# Altium schematic sheet MRAM.SchDoc
size A4
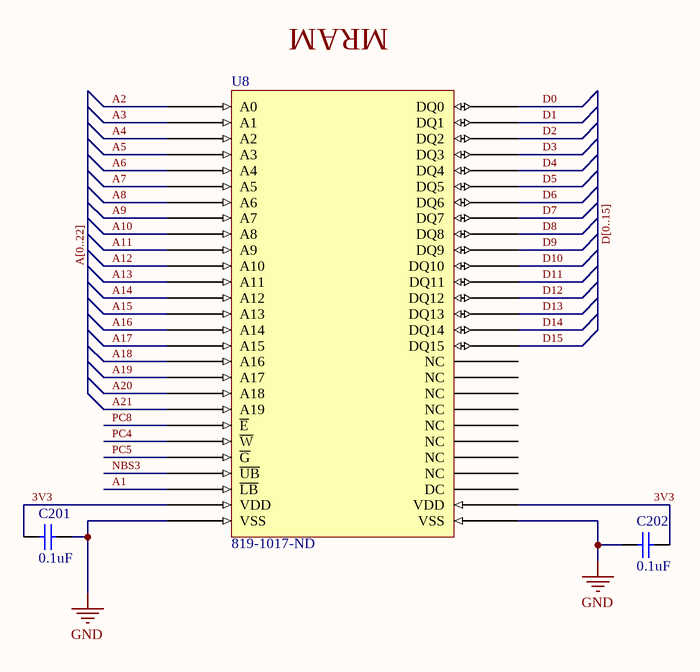
[diagram p0: MRAM.SchDoc]

## Parts
C201  value 0.1uF  [CAPC2008X06N]  (hidden comment: Kemet_0805_a_0.1uF)
C202  value 0.1uF  [CAPC2008X06N]  (hidden comment: Kemet_0805_a_0.1uF)
U8  Supplier Part Number 1: 819-1017-ND  [TSOP80P1180X120_HS-54N]  (hidden comment: MRAM (Magnetoresistive RAM))

## Nets
GND: C201.2 C202.1 U8.14(VSS) U8.42(VSS)
3V3: C201.1 C202.2 U8.13(VDD) U8.41(VDD)
A1: U8.47(~{LB})
A2: U8.3(A0)
A3: U8.4(A1)
A4: U8.5(A2)
A5: U8.6(A3)
A6: U8.7(A4)
A7: U8.20(A5)
A8: U8.21(A6)
A9: U8.22(A7)
A10: U8.23(A8)
A11: U8.24(A9)
A12: U8.31(A10)
A13: U8.32(A11)
A14: U8.33(A12)
A15: U8.34(A13)
A16: U8.35(A14)
A17: U8.50(A15)
A18: U8.51(A16)
A19: U8.52(A17)
A20: U8.53(A18)
A21: U8.2(A19)
D0: U8.9(DQ0)
D1: U8.10(DQ1)
D2: U8.11(DQ2)
D3: U8.12(DQ3)
D4: U8.15(DQ4)
D5: U8.16(DQ5)
D6: U8.17(DQ6)
D7: U8.18(DQ7)
D8: U8.37(DQ8)
D9: U8.38(DQ9)
D10: U8.39(DQ10)
D11: U8.40(DQ11)
D12: U8.43(DQ12)
D13: U8.44(DQ13)
D14: U8.45(DQ14)
D15: U8.46(DQ15)
NBS3: U8.48(~{UB})
PC4: U8.19(~{W})
PC5: U8.49(~{G})
PC8: U8.8(~{E})

Not connected (* = marked no-connect by the designer): U8 1(NC) 25(NC) 26(NC) 27(NC) 28(NC) 29(NC) 30(NC) 36(DC) 54(NC)

## Buses and harness runs
bus A[0..22]
bus D[0..15]

## Notes on the sheet
- (near U8) MRAM

## Library data of the parts
C201 C202 = Kemet_0805_a_0.1uF: CAP CER 0.1UF 50V 10% X7R 0805; Supplier 1: Digi-Key; Supplier Part Number 1: 399-1170-1-ND
U8 = MR4A16BCYS35: IC MRAM 16MBIT 35NS 54TSOP; ComponentLink1Description: Manufacturer Link; ComponentLink1URL: http://www.everspin.com/; ComponentLink2Description: Datasheet; ComponentLink2URL: http://www.everspin.com/PDF/EST_MR4A16B_preliminary.pdf; PackageDescription: 54 TSOP; Supplier 1: Digi-Key